# Altium schematic sheet Schematics.SchDoc
size A4
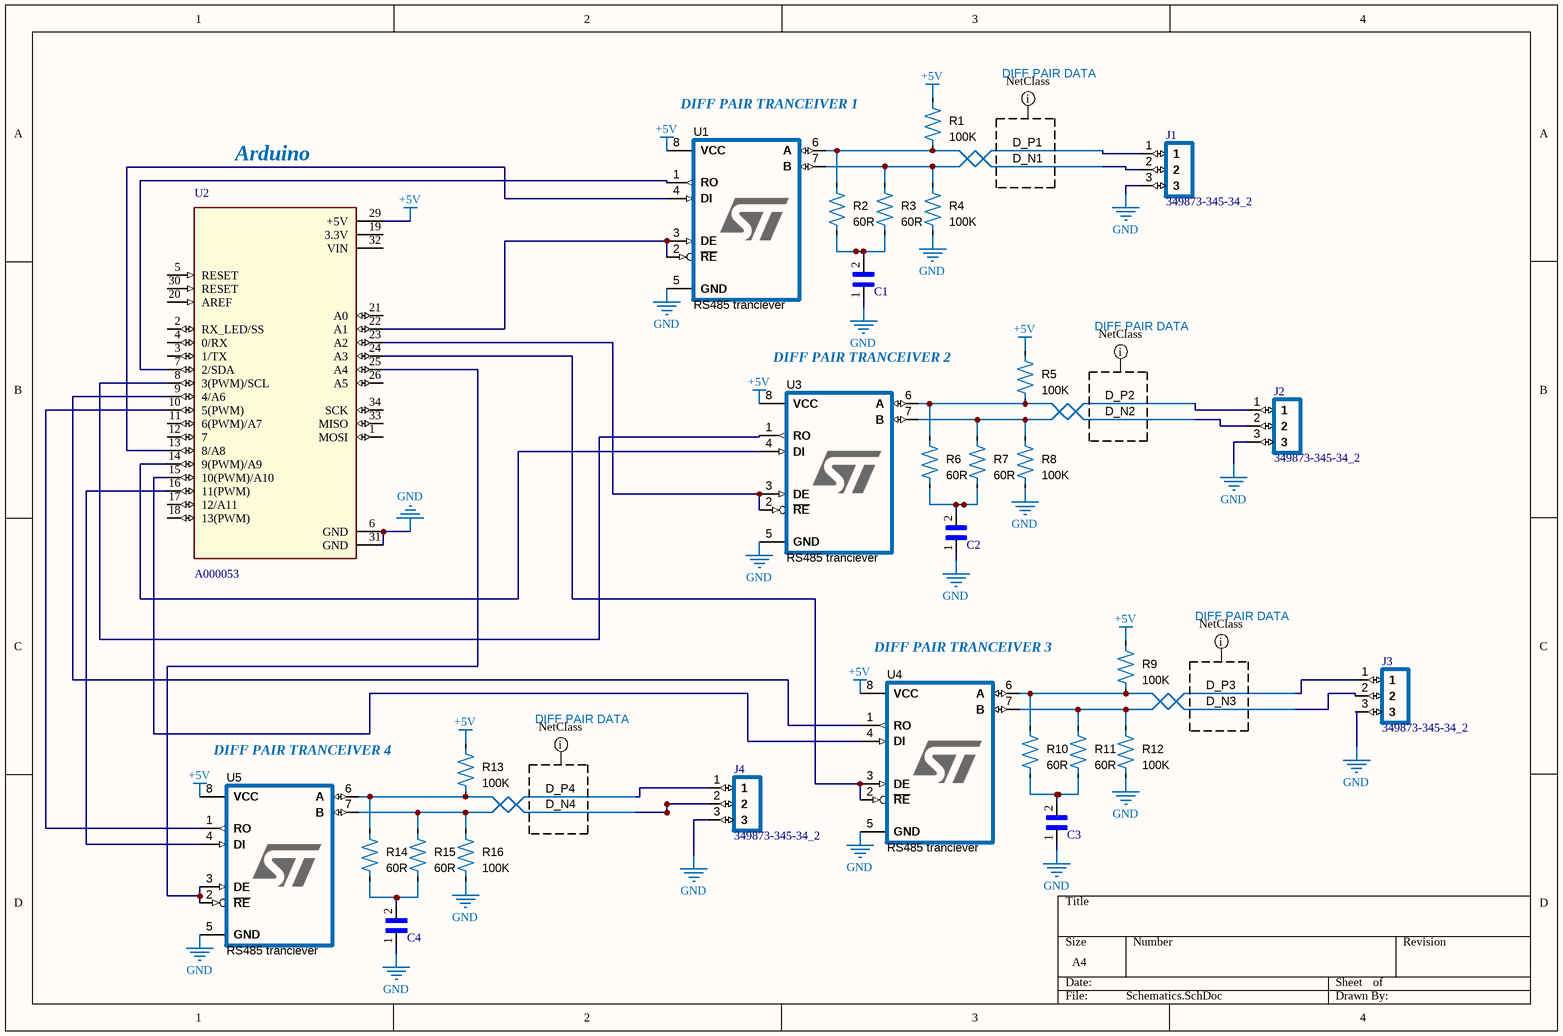
[diagram p0: Schematics.SchDoc]

## Parts
C1  06035C104K4Z2A  [1608[0603]]  (value not drawn)
C2  06035C104K4Z2A  [1608[0603]]  (value not drawn)
C3  06035C104K4Z2A  [1608[0603]]  (value not drawn)
C4  06035C104K4Z2A  [1608[0603]]  (value not drawn)
J1  349873-345-34_2  [Header 1x3 male]
J2  349873-345-34_2  [Header 1x3 male]
J3  349873-345-34_2  [Header 1x3 male]
J4  349873-345-34_2  [Header 1x3 male]
R1  value 100K  [R0603]  (hidden comment: CPF-A-0603B100KE1)
R2  value 60R  [R0603]  (hidden comment: CPF-A-0603B100KE1)
R3  value 60R  [R0603]  (hidden comment: CPF-A-0603B100KE1)
R4  value 100K  [R0603]  (hidden comment: CPF-A-0603B100KE1)
R5  value 100K  [R0603]  (hidden comment: CPF-A-0603B100KE1)
R6  value 60R  [R0603]  (hidden comment: CPF-A-0603B100KE1)
R7  value 60R  [R0603]  (hidden comment: CPF-A-0603B100KE1)
R8  value 100K  [R0603]  (hidden comment: CPF-A-0603B100KE1)
R9  value 100K  [R0603]  (hidden comment: CPF-A-0603B100KE1)
R10  value 60R  [R0603]  (hidden comment: CPF-A-0603B100KE1)
R11  value 60R  [R0603]  (hidden comment: CPF-A-0603B100KE1)
R12  value 100K  [R0603]  (hidden comment: CPF-A-0603B100KE1)
R13  value 100K  [R0603]  (hidden comment: CPF-A-0603B100KE1)
R14  value 60R  [R0603]  (hidden comment: CPF-A-0603B100KE1)
R15  value 60R  [R0603]  (hidden comment: CPF-A-0603B100KE1)
R16  value 100K  [R0603]  (hidden comment: CPF-A-0603B100KE1)
U1  RS485 tranciever  [ST485CDR]
U2  A000053  [*ARDUINO_A000053]
U3  RS485 tranciever  [ST485CDR]
U4  RS485 tranciever  [ST485CDR]
U5  RS485 tranciever  [ST485CDR]

## Nets
+5V: R1.2 R5.2 R9.2 R13.2 U1.8(VCC) U2.29(+5V) U3.8(VCC) U4.8(VCC) U5.8(VCC)
GND: C1.1 C2.1 C3.1 C4.1 J1.3 J2.3 J3.3 J4.3 R4.1 R8.1 R12.1 R16.1 U1.5(GND) U2.6(GND) U2.31(GND) U3.5(GND) U4.5(GND) U5.5(GND)
D_N1: J1.2 R3.2 R4.2 U1.7(B)
D_N2: J2.2 R7.2 R8.2 U3.7(B)
D_N3: J3.2 R11.2 R12.2 U4.7(B)
D_N4: J4.2 R15.2 R16.2 U5.7(B)
D_P1: J1.1 R1.1 R2.2 U1.6(A)
D_P2: J2.1 R5.1 R6.2 U3.6(A)
D_P3: J3.1 R9.1 R10.2 U4.6(A)
D_P4: J4.1 R13.1 R14.2 U5.6(A)
NetC1_2: C1.2 R2.1 R3.1
NetC2_2: C2.2 R6.1 R7.1
NetC3_2: C3.2 R10.1 R11.1
NetC4_2: C4.2 R14.1 R15.1
NetU1_1: U1.1(RO) U2.7(2/SDA)
NetU1_2: U1.2(~{RE}) U1.3(DE) U2.22(A1)
NetU1_4: U1.4(DI) U2.13(8/A8)
NetU2_8: U2.8(3(PWM)/SCL) U3.1(RO)
NetU2_9: U2.9(4/A6) U4.1(RO)
NetU2_10: U2.10(5(PWM)) U5.1(RO)
NetU2_14: U2.14(9(PWM)/A9) U3.4(DI)
NetU2_15: U2.15(10(PWM)/A10) U4.4(DI)
NetU2_16: U2.16(11(PWM)) U5.4(DI)
NetU2_23: U2.23(A2) U3.2(~{RE}) U3.3(DE)
NetU2_24: U2.24(A3) U4.2(~{RE}) U4.3(DE)
NetU2_25: U2.25(A4) U5.2(~{RE}) U5.3(DE)

Not connected (* = marked no-connect by the designer): U2 1(MOSI) 2(RX_LED/SS) 3(1/TX) 4(0/RX) 5(RESET) 11(6(PWM)/A7) 12(7) 17(12/A11) 18(13(PWM)) 19(3.3V) 20(AREF) 21(A0) 26(A5) 30(RESET) 32(VIN) 33(MISO) 34(SCK)

## Layout directives
net class DIFF PAIR DATA: D_N1, D_N2, D_N3, D_N4, D_P1, D_P2, D_P3, D_P4

## Notes on the sheet
- (near U1) DIFF PAIR TRANCEIVER 1
- Arduino
- (near U3) DIFF PAIR TRANCEIVER 2
- (near U4) DIFF PAIR TRANCEIVER 3
- (near U5) DIFF PAIR TRANCEIVER 4

## Library data of the parts
C1-C4 = 06035C104K4Z2A: 0.1ÂµF Â±10% 50V Ceramic Capacitor X7R 0603 _1608 Metric_; MF: AVX; Value: *; Package: 1608 AVX; Digi-Key_Part_Number: 478-6344-1-ND; SnapEDA_Link: https://www.snapeda.com/parts/06035C104K4Z2A/AVX/view-part/572777/?ref=snap; MP: 06035C104K4Z2A
J1-J4 = 349873-345-34_2: Header 1x3 male 2.54mm
R1-R16 = CPF-A-0603B100KE1: R0603
U1 U3-U5 = ST485CDR: RS485 tranciever single; Supplier Part Number 1: 1564307; Supplier 1: Farnell
U2 = A000053: MCU, ARDUINO MICRO, LEONARDO BASED, ATMEGA32u4, 5V, USB-MICRO; Availability: Unavailable; Price: None; SnapEDA_Link: https://www.snapeda.com/parts/A000053/Arduino/view-part/?ref=snap; MF: Arduino; MP: A000053; Package: None; Value: *